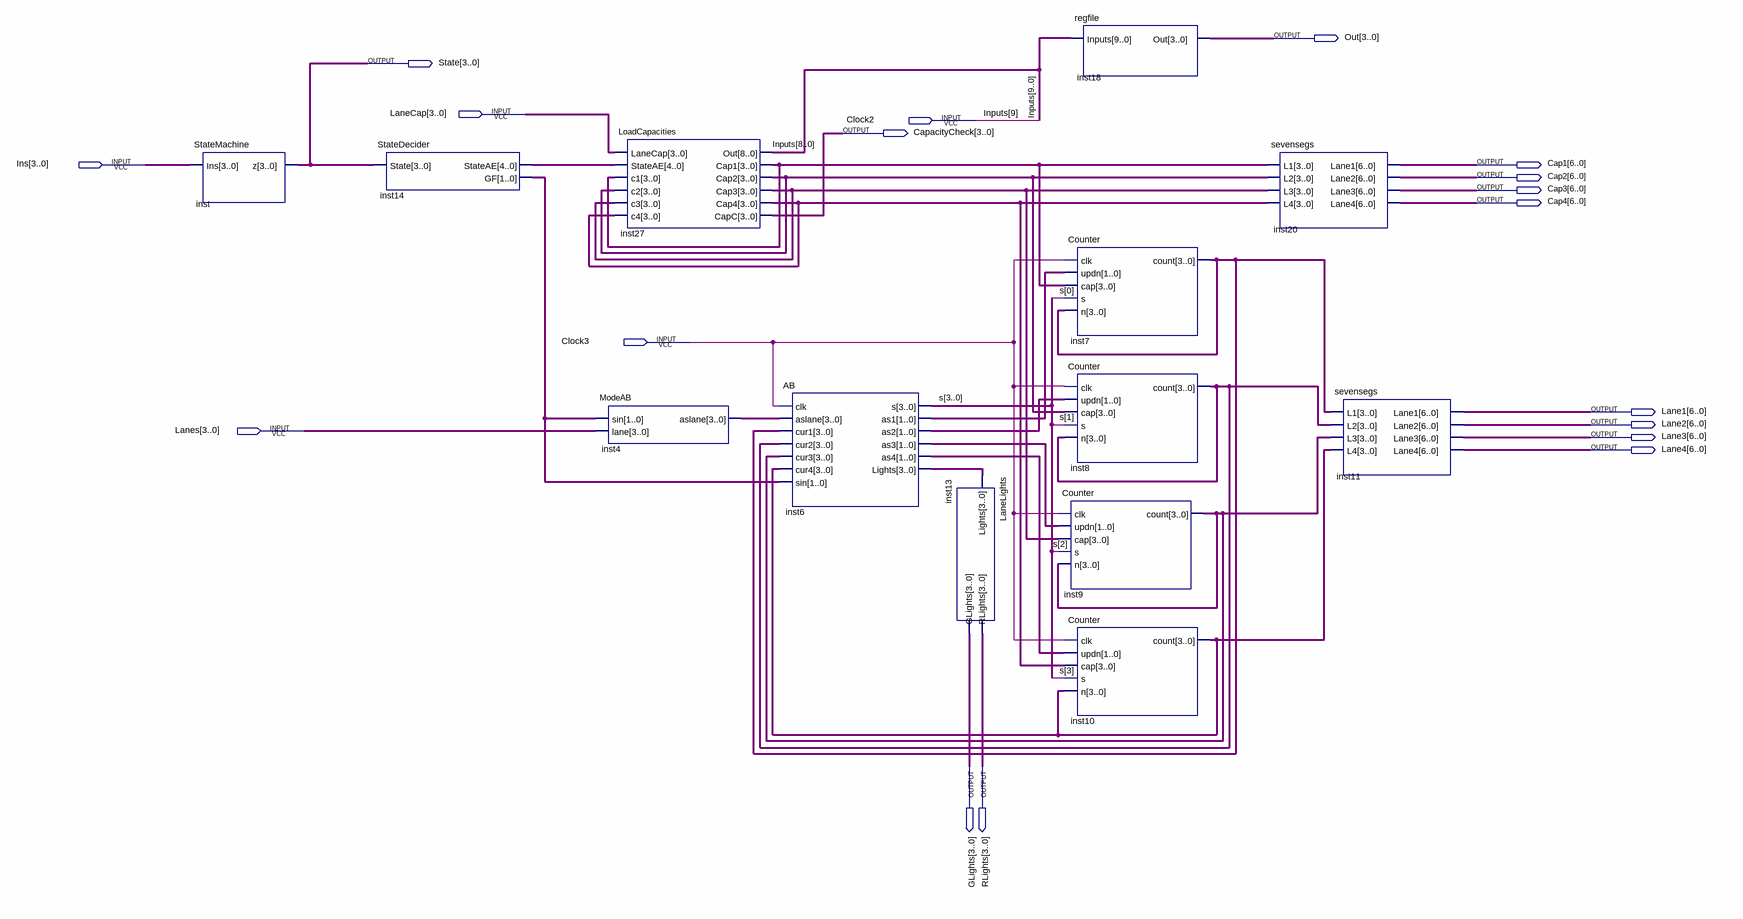
[diagram p0: schematic sheet]
// Quartus schematic Final_Circuit.bdf as structural Verilog: 13 symbols, 18 pins
module Final_Circuit (
  input  [3:0] LaneCap,
  input  Clock2,
  input  [3:0] Ins,
  input  Clock3,
  input  [3:0] Lanes,
  output [3:0] Out,
  output [3:0] State,
  output [3:0] CapacityCheck,
  output [6:0] Cap1,
  output [6:0] Cap2,
  output [6:0] Cap3,
  output [6:0] Cap4,
  output [6:0] Lane1,
  output [6:0] Lane2,
  output [6:0] Lane3,
  output [6:0] Lane4,
  output [3:0] GLights,
  output [3:0] RLights
);

  wire [1:0] inst6_as1, inst6_as2, inst6_as3, inst6_as4, inst14_gf;
  wire [3:0] inst4_aslane, inst6_lights, inst7_count, inst8_count, inst9_count, inst10_count, inst27_cap1,
       inst27_cap2, inst27_cap3, inst27_cap4, s;
  wire [4:0] inst14_stateae;
  wire [8:0] Inputs;

  StateMachine inst (.Ins(Ins), .z(State));
  StateDecider inst14 (.State(State), .StateAE(inst14_stateae), .GF(inst14_gf));
  LoadCapacities inst27 (
    .LaneCap(LaneCap), .StateAE(inst14_stateae), .c1(inst27_cap1), .c2(inst27_cap2), .c3(inst27_cap3),
    .c4(inst27_cap4), .Out(Inputs), .Cap1(inst27_cap1), .Cap2(inst27_cap2), .Cap3(inst27_cap3),
    .Cap4(inst27_cap4), .CapC(CapacityCheck));
  ModeAB inst4 (.sin(inst14_gf), .lane(Lanes), .aslane(inst4_aslane));
  AB inst6 (
    .clk(Clock3), .aslane(inst4_aslane), .cur1(inst7_count), .cur2(inst8_count), .cur3(inst9_count),
    .cur4(inst10_count), .sin(inst14_gf), .s(s), .as1(inst6_as1), .as2(inst6_as2), .as3(inst6_as3),
    .as4(inst6_as4), .Lights(inst6_lights));
  LaneLights inst13 (.Lights(inst6_lights), .RLights(RLights), .GLights(GLights));
  regfile inst18 (.Inputs({Clock2, Inputs}), .Out(Out));
  Counter inst7 (.clk(Clock3), .updn(inst6_as1), .cap(inst27_cap1), .s(s[0]), .n(inst7_count), .count(inst7_count));
  Counter inst8 (.clk(Clock3), .updn(inst6_as2), .cap(inst27_cap2), .s(s[1]), .n(inst8_count), .count(inst8_count));
  Counter inst9 (.clk(Clock3), .updn(inst6_as3), .cap(inst27_cap3), .s(s[2]), .n(inst9_count), .count(inst9_count));
  Counter inst10 (.clk(Clock3), .updn(inst6_as4), .cap(inst27_cap4), .s(s[3]), .n(inst10_count), .count(inst10_count));
  sevensegs inst20 (
    .L1(inst27_cap1), .L2(inst27_cap2), .L3(inst27_cap3), .L4(inst27_cap4), .Lane1(Cap1), .Lane2(Cap2),
    .Lane3(Cap3), .Lane4(Cap4));
  sevensegs inst11 (
    .L1(inst7_count), .L2(inst8_count), .L3(inst9_count), .L4(inst10_count), .Lane1(Lane1), .Lane2(Lane2),
    .Lane3(Lane3), .Lane4(Lane4));

  // Other names for the same wires on the sheet: Inputs[9] = Clock2
endmodule
